# EAGLE design AeroReceiver01 (EAGLE 5.07)
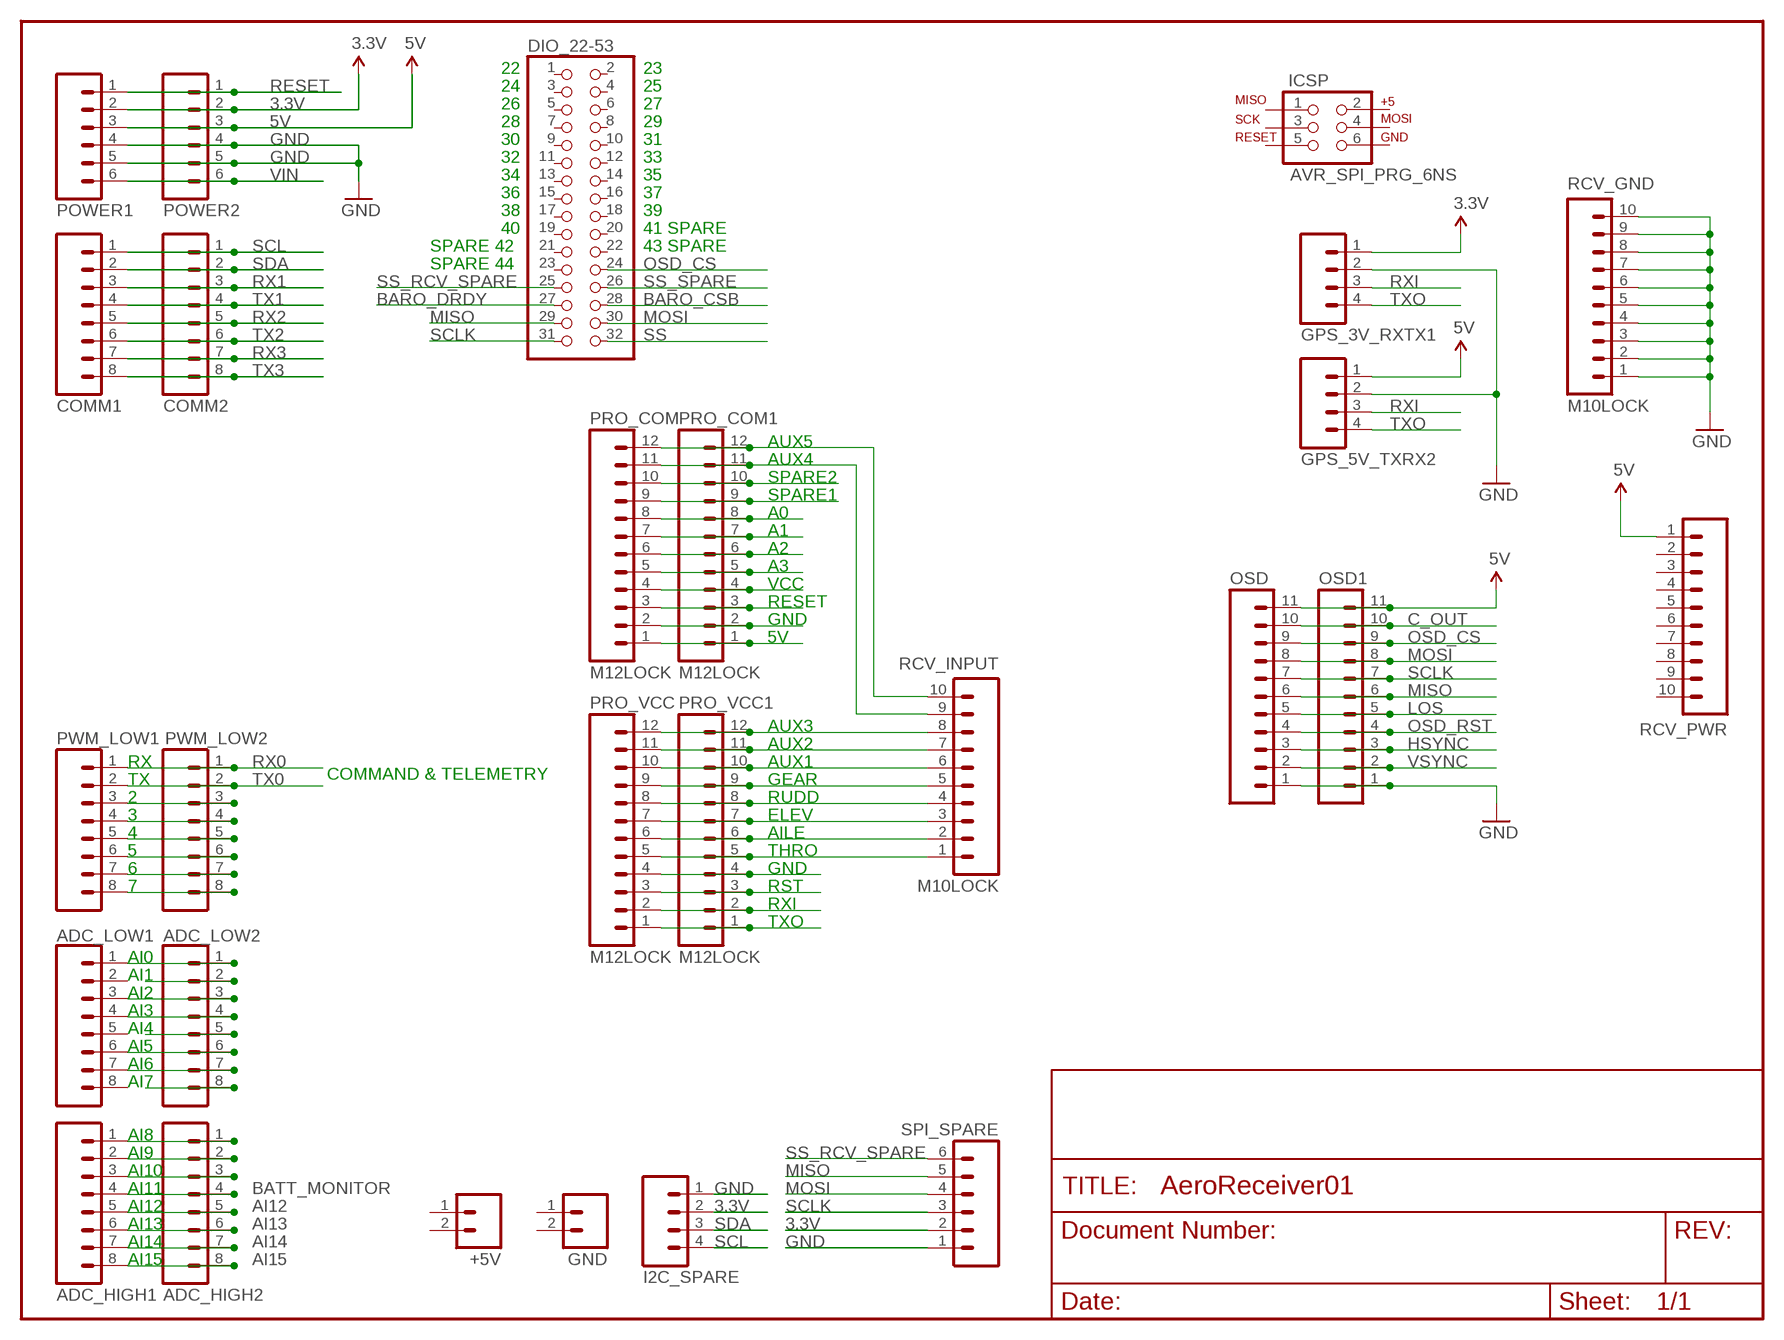
[diagram p0: schematic, sheet 1]

## Parts
+5V  M02PTH  [1X02]
ADC_HIGH1  M08LOCK  [1X08_LOCK]
ADC_HIGH2  M08LOCK  [1X08_LOCK]
ADC_LOW1  M08LOCK  [1X08_LOCK]
ADC_LOW2  M08LOCK  [1X08_LOCK]
COMM1  M08LOCK  [1X08_LOCK]
COMM2  M08LOCK  [1X08_LOCK]
DIO_22-53  PINHD-2X16  [2X16]
GND  M02PTH  [1X02]
GPS_3V_RXTX1  M04LOCK  [1X04_LOCK]
GPS_5V_TXRX2  M04LOCK  [1X04_LOCK]
I2C_SPARE  M04LOCK  [1X04_LOCK]
ICSP  AVR_SPI_PRG_6NS  [2X3-NS]
OSD  M11LOCK  [1X11_LOCK]
OSD1  M11LOCK  [1X11_LOCK]
POWER1  M06LOCK  [1X06_LOCK]
POWER2  M06LOCK  [1X06_LOCK]
PRO_COM  M12LOCK  [1X12_LOCK]
PRO_COM1  M12LOCK  [1X12_LOCK]
PRO_VCC  M12LOCK  [1X12_LOCK]
PRO_VCC1  M12LOCK  [1X12_LOCK]
PWM_LOW1  M08LOCK  [1X08_LOCK]
PWM_LOW2  M08LOCK  [1X08_LOCK]
RCV_GND  M10LOCK  [1X10_LOCK]
RCV_INPUT  M10LOCK  [1X10_LOCK]
RCV_PWR  M10LOCK  [1X10_LOCK]
SPI_SPARE  M06LOCK  [1X06_LOCK]

## Nets
3.3V: GPS_3V_RXTX1.1 I2C_SPARE.2 POWER1.2 POWER2.2 SPI_SPARE.2
5V: GPS_5V_TXRX2.1 OSD1.11 OSD.11 POWER1.3 POWER2.3 PRO_COM1.1 PRO_COM.1 RCV_PWR.1
A0: PRO_COM1.8 PRO_COM.8
A1: PRO_COM1.7 PRO_COM.7
A2: PRO_COM1.6 PRO_COM.6
A3: PRO_COM1.5 PRO_COM.5
AI12: ADC_HIGH1.5 ADC_HIGH2.5
AI13: ADC_HIGH1.6 ADC_HIGH2.6
AI14: ADC_HIGH1.7 ADC_HIGH2.7
AI15: ADC_HIGH1.8 ADC_HIGH2.8
AILE: PRO_VCC1.6 PRO_VCC.6 RCV_INPUT.2
AUX1: PRO_VCC1.10 PRO_VCC.10 RCV_INPUT.6
AUX2: PRO_VCC1.11 PRO_VCC.11 RCV_INPUT.7
AUX3: PRO_VCC1.12 PRO_VCC.12 RCV_INPUT.8
AUX4: PRO_COM1.11 PRO_COM.11 RCV_INPUT.9
AUX5: PRO_COM1.12 PRO_COM.12 RCV_INPUT.10
BARO_CSB: DIO_22-53.28
BARO_DRDY: DIO_22-53.27
BATT_MONITOR: ADC_HIGH1.4 ADC_HIGH2.4
C_OUT: OSD1.10 OSD.10
ELEV: PRO_VCC1.7 PRO_VCC.7 RCV_INPUT.3
GEAR: PRO_VCC1.9 PRO_VCC.9 RCV_INPUT.5
GND: GPS_3V_RXTX1.2 GPS_5V_TXRX2.2 I2C_SPARE.1 OSD1.1 OSD.1 POWER1.4 POWER1.5 POWER2.4 POWER2.5 PRO_COM1.2 PRO_COM.2 PRO_VCC1.4 PRO_VCC.4 RCV_GND.1 RCV_GND.2 RCV_GND.3 RCV_GND.4 RCV_GND.5 RCV_GND.6 RCV_GND.7 RCV_GND.8 RCV_GND.9 RCV_GND.10 SPI_SPARE.1
HSYNC: OSD1.3 OSD.3
LOS: OSD1.5 OSD.5
MISO: DIO_22-53.29 OSD1.6 OSD.6 SPI_SPARE.5
MOSI: DIO_22-53.30 OSD1.8 OSD.8 SPI_SPARE.4
N$1: ADC_LOW1.1 ADC_LOW2.1
N$2: ADC_LOW2.2
N$3: ADC_LOW1.3 ADC_LOW2.3
N$4: ADC_LOW1.4 ADC_LOW2.4
N$5: ADC_LOW2.5
N$6: ADC_LOW1.6 ADC_LOW2.6
N$7: ADC_LOW1.7 ADC_LOW2.7
N$8: ADC_LOW2.8
N$9: ADC_HIGH1.1 ADC_HIGH2.1
N$10: ADC_HIGH1.2 ADC_HIGH2.2
N$11: ADC_HIGH1.3 ADC_HIGH2.3
N$12: PWM_LOW1.3 PWM_LOW2.3
N$13: PWM_LOW1.4 PWM_LOW2.4
N$14: PWM_LOW1.5 PWM_LOW2.5
N$15: PWM_LOW1.6 PWM_LOW2.6
N$16: PWM_LOW1.7 PWM_LOW2.7
N$17: PWM_LOW1.8 PWM_LOW2.8
OSD_CS: DIO_22-53.24 OSD1.9 OSD.9
OSD_RST: OSD1.4 OSD.4
RESET: POWER1.1 POWER2.1 PRO_COM1.3 PRO_COM.3
RST: PRO_VCC1.3 PRO_VCC.3
RUDD: PRO_VCC1.8 PRO_VCC.8 RCV_INPUT.4
RX0: PWM_LOW1.1 PWM_LOW2.1
RX1: COMM1.3 COMM2.3
RX2: COMM1.5 COMM2.5
RX3: COMM1.7 COMM2.7
RXI: GPS_3V_RXTX1.3 GPS_5V_TXRX2.3 PRO_VCC1.2 PRO_VCC.2
SCL: COMM1.1 COMM2.1 I2C_SPARE.4
SCLK: DIO_22-53.31 OSD1.7 OSD.7 SPI_SPARE.3
SDA: COMM1.2 COMM2.2 I2C_SPARE.3
SPARE1: PRO_COM1.9 PRO_COM.9
SPARE2: PRO_COM1.10 PRO_COM.10
SS: DIO_22-53.32
SS_RCV_SPARE: DIO_22-53.25 SPI_SPARE.6
SS_SPARE: DIO_22-53.26
THRO: PRO_VCC1.5 PRO_VCC.5 RCV_INPUT.1
TX0: PWM_LOW1.2 PWM_LOW2.2
TX1: COMM1.4 COMM2.4
TX2: COMM1.6 COMM2.6
TX3: COMM1.8 COMM2.8
TXO: GPS_3V_RXTX1.4 GPS_5V_TXRX2.4 PRO_VCC1.1 PRO_VCC.1
VCC: PRO_COM1.4 PRO_COM.4
VIN: POWER1.6 POWER2.6
VSYNC: OSD1.2 OSD.2
Unconnected: +5V.1 +5V.2 ADC_LOW1.2 ADC_LOW1.5 ADC_LOW1.8 DIO_22-53.1 DIO_22-53.2 DIO_22-53.3 DIO_22-53.4 DIO_22-53.5 DIO_22-53.6 DIO_22-53.7 DIO_22-53.8 DIO_22-53.9 DIO_22-53.10 DIO_22-53.11 DIO_22-53.12 DIO_22-53.13 DIO_22-53.14 DIO_22-53.15 DIO_22-53.16 DIO_22-53.17 DIO_22-53.18 DIO_22-53.19 DIO_22-53.20 DIO_22-53.21 DIO_22-53.22 DIO_22-53.23 GND.1 GND.2 ICSP.1 ICSP.2 ICSP.3 ICSP.4 ICSP.5 ICSP.6 RCV_PWR.2 RCV_PWR.3 RCV_PWR.4 RCV_PWR.5 RCV_PWR.6 RCV_PWR.7 RCV_PWR.8 RCV_PWR.9 RCV_PWR.10

## Notes on the sheet
- 22 | 23
- 24 | 25
- 26 | 27
- 28 | 29
- 30 | 31
- 32 | 33
- 34 | 35
- 36 | 37
- 38 | 39
- 40 | 41 SPARE
- SPARE 42 | 43 SPARE
- SPARE 44
- RX
- COMMAND & TELEMETRY
- TX
- 2
- 3
- 4
- 5
- 6
- 7
- AI0
- AI1
- AI2
- AI3
- AI4
- AI5
- AI6
- AI7
- AI8
- AI9
- AI10
- AI11
- AI12
- AI13
- AI14
- AI15

## Library data of the parts
+5V GND = SparkFun:M02: Header 2 Standard 2-pin 0.1" header. Use with straight break away headers (SKU : PRT-00116), right angle break away headers (PRT-00553), swiss pins (PRT-00743), machine pins (PRT-00117), and female headers (PRT-00115). Molex polarized connector foot print use with SKU : PRT-08233 with associated crimp pins and housings.
ADC_HIGH1 ADC_HIGH2 ADC_LOW1 ADC_LOW2 COMM1 COMM2 PWM_LOW1 PWM_LOW2 = SparkFun:M08: Header 8 Standard 8-pin 0.1" header. Use with straight break away headers (SKU : PRT-00116), right angle break away headers (PRT-00553), swiss pins (PRT-00743), machine pins (PRT-00117), and female headers (PRT-00115).
DIO_22-53 = pinhead:PINHD-2X16: PIN HEADER
GPS_3V_RXTX1 GPS_5V_TXRX2 I2C_SPARE = SparkFun:M04: Header 4 Standard 4-pin 0.1" header. Use with straight break away headers (SKU : PRT-00116), right angle break away headers (PRT-00553), swiss pins (PRT-00743), machine pins (PRT-00117), and female headers (PRT-00115). Molex polarized connector foot print use with SKU : PRT-08231 with associated crimp pins and housings.
ICSP = SparkFun:AVR_SPI_PRG_6: AVR ISP 6 Pin This is the reduced ISP connector for AVR programming. Common on Arduino. This footprint will take up less PCB space and can be used with a 10-pin to 6-pin adapter such as SKU: BOB-08508
OSD OSD1 = SparkFun:M11: Header 11 Standard 11-pin 0.1" header. Use with straight break away headers (SKU : PRT-00116), right angle break away headers (PRT-00553), swiss pins (PRT-00743), machine pins (PRT-00117), and female headers (PRT-00115).
POWER1 POWER2 SPI_SPARE = SparkFun:M06: Header 6 Standard 6-pin 0.1" header. Use with straight break away headers (SKU : PRT-00116), right angle break away headers (PRT-00553), swiss pins (PRT-00743), machine pins (PRT-00117), and female headers (PRT-00115). Molex polarized connector foot print use with SKU : PRT-08094 with associated crimp pins and housings. NOTES ON THE VARIANTS LOCK and LOCK_LONGPADS... This footprint was designed to help hold the alignment of a through-hole component (i.e. 6-pin header) while soldering it into place. You may notice that each hole has been shifted either up or down by 0.005 of an inch from it's more standard position (which is a perfectly straight line). This slight alteration caused the pins (the squares in the middle) to touch the edges of the holes. Because they are alternating, it causes a "brace" to hold the component in place. 0.005 has proven to be the perfect amount of "off-center" position when using our standard breakaway headers. Although looks a little odd when you look at the bare footprint, once you have a header in there, the alteration is very hard to notice. Also, if you push a header all the way into place, it is covered up entirely on the bottom side. This idea of altering the position of holes to aid alignment will be further integrated into the Sparkfun Library for other footprints. It can help hold any component with 3 or more connection pins.
PRO_COM PRO_COM1 PRO_VCC PRO_VCC1 = SparkFun:M12: Header 12 Standard 12-pin 0.1" header. Use with straight break away headers (SKU : PRT-00116), right angle break away headers (PRT-00553), swiss pins (PRT-00743), machine pins (PRT-00117), and female headers (PRT-00115).
RCV_GND RCV_INPUT RCV_PWR = SparkFun:M10: Header 10 Standard 10-pin 0.1" header. Use with straight break away headers (SKU : PRT-00116), right angle break away headers (PRT-00553), swiss pins (PRT-00743), machine pins (PRT-00117), and female headers (PRT-00115).

## Board
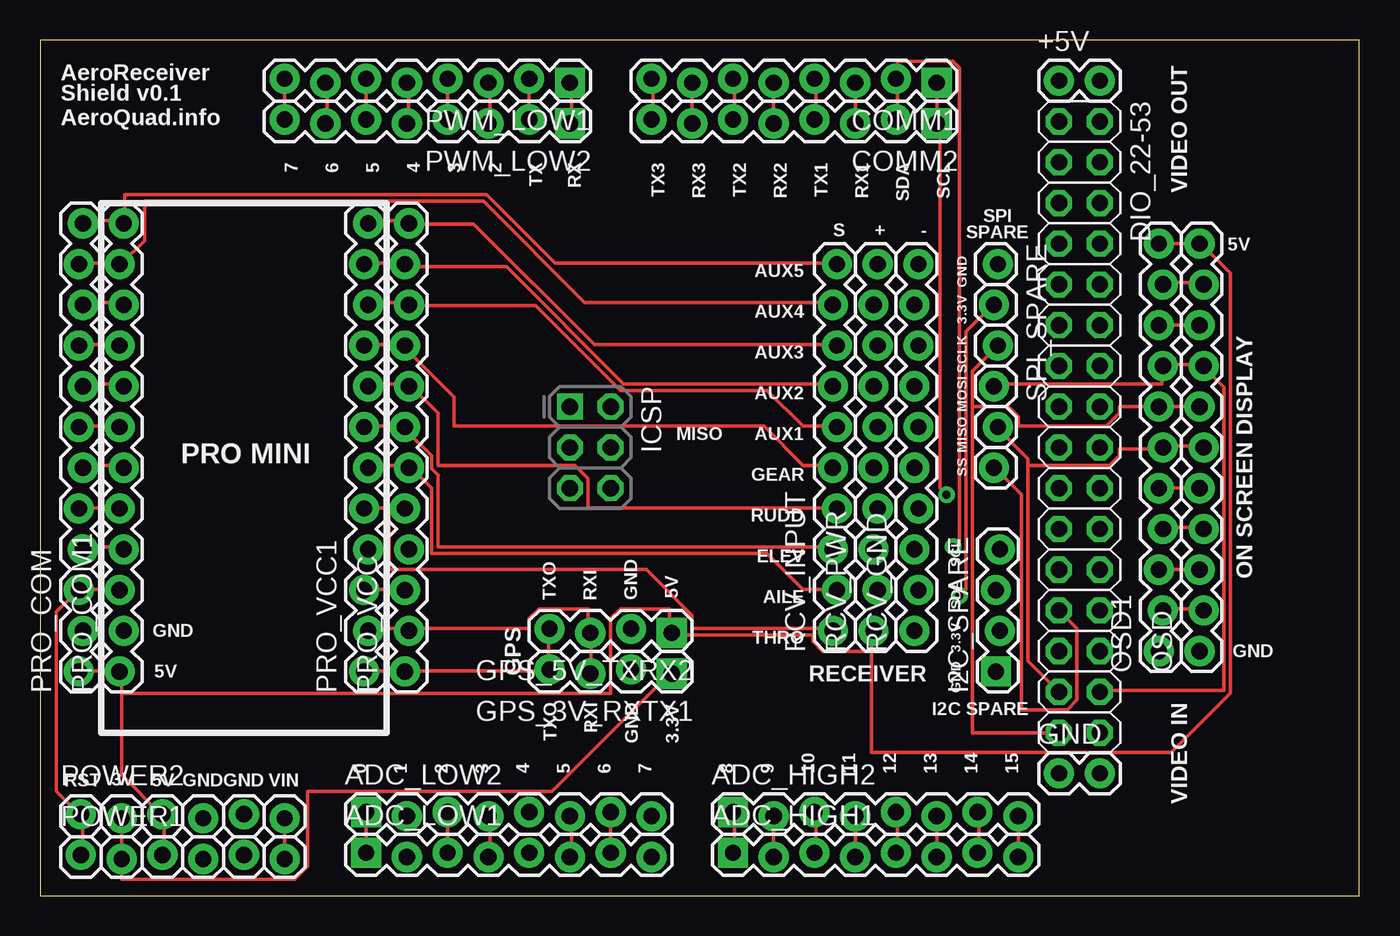
[diagram p1: board, top side]
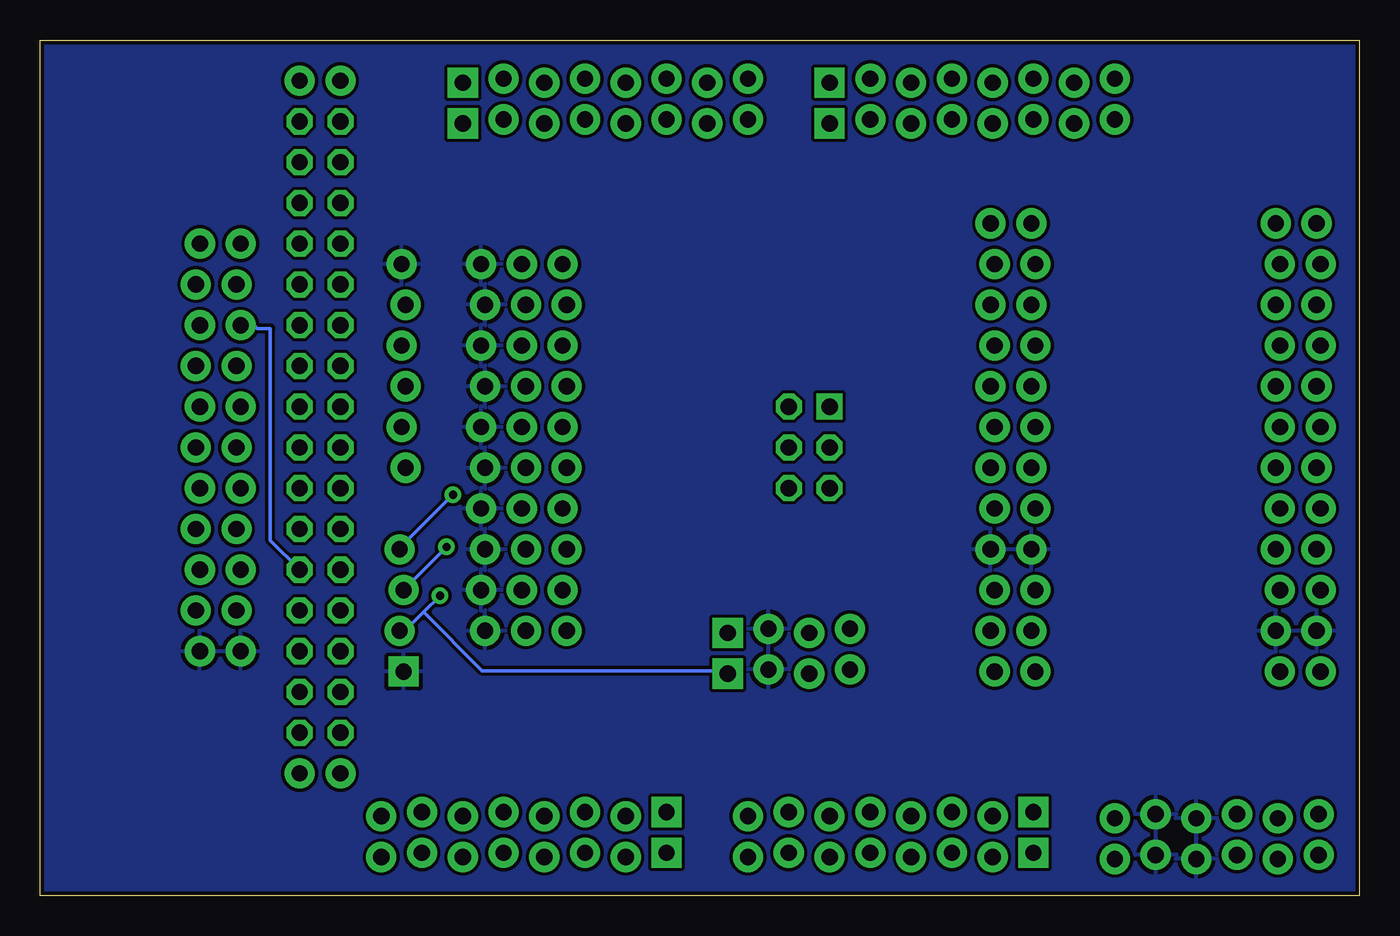
[diagram p2: board, bottom side, seen from below]

Size 82.22 x 53.33 mm. Coordinates in mm from the lower left corner, seen from the top.
Outline: 0,0 82.22,0 82.22,53.33 0,53.33 0,0
Copper layers (1*16): Top 0.035mm / dielectric 1.5mm / Bottom 0.035mm
Design rules "SparkFun": minimum track width 8mil, minimum drill 20mil, track to track 8mil, track to pad 8mil, pad to pad 8mil, via to via 8mil, smd to smd 8mil, copper to edge 10mil, drill to drill 8mil, minimum pad ring 12mil, minimum via ring 10mil, stop-mask expansion 4mil, vias tented up to drill 25mil, thermal gap 10mil

### Footprints (pad centres in the part's own frame; a part is rotated, then mirrored left to right if it is on the bottom)
1X02 = drill 1.016 pad 1.88 round: 1 0,0; 2 2.54,0
1X08_LOCK = drill 1.016 pad 1.88 square: 1 0,0.127 | drill 1.016 pad 1.88 round: 2 2.54,-0.127; 3 5.08,0.127; 4 7.62,-0.127; 5 10.16,0.127; 6 12.7,-0.127; 7 15.24,0.127; 8 17.78,-0.127
2X16 = drill 1.016 octagon: 1 -19.05,-1.27; 2 -19.05,1.27; 3 -16.51,-1.27; 4 -16.51,1.27; 5 -13.97,-1.27; 6 -13.97,1.27; 7 -11.43,-1.27; 8 -11.43,1.27; 9 -8.89,-1.27; 10 -8.89,1.27; 11 -6.35,-1.27; 12 -6.35,1.27; 13 -3.81,-1.27; 14 -3.81,1.27; 15 -1.27,-1.27; 16 -1.27,1.27; 17 1.27,-1.27; 18 1.27,1.27; 19 3.81,-1.27; 20 3.81,1.27; 21 6.35,-1.27; 22 6.35,1.27; 23 8.89,-1.27; 24 8.89,1.27; 25 11.43,-1.27; 26 11.43,1.27; 27 13.97,-1.27; 28 13.97,1.27; 29 16.51,-1.27; 30 16.51,1.27; 31 19.05,-1.27; 32 19.05,1.27
1X04_LOCK = drill 1.016 pad 1.88 square: 1 0,0.127 | drill 1.016 pad 1.88 round: 2 2.54,-0.127; 3 5.08,0.127; 4 7.62,-0.127
2X3-NS = drill 1.016 square: 1 -2.54,-1.27 | drill 1.016 octagon: 2 -2.54,1.27; 3 0,-1.27; 4 0,1.27; 5 2.54,-1.27; 6 2.54,1.27
1X11_LOCK = drill 1.016 pad 1.88 round: 1 0,0.127; 2 2.54,-0.127; 3 5.08,0.127; 4 7.62,-0.127; 5 10.16,0.127; 6 12.7,-0.127; 7 15.24,0.127; 8 17.78,-0.127; 9 20.32,0.127; 10 22.86,-0.127; 11 25.4,0.127
1X06_LOCK = drill 1.016 pad 1.88 round: 1 0,0; 2 2.54,-0.254; 3 5.08,0; 4 7.62,-0.254; 5 10.16,0; 6 12.7,-0.254
1X12_LOCK = drill 1.016 pad 1.88 round: 1 0,0.127; 2 2.54,-0.127; 3 5.08,0.127; 4 7.62,-0.127; 5 10.16,0.127; 6 12.7,-0.127; 7 15.24,0.127; 8 17.78,-0.127; 9 20.32,0.127; 10 22.86,-0.127; 11 25.4,0.127; 12 27.94,-0.127
1X10_LOCK = drill 1.016 pad 1.88 round: 1 0,0.127; 2 2.54,-0.127; 3 5.08,0.127; 4 7.62,-0.127; 5 10.16,0.127; 6 12.7,-0.127; 7 15.24,0.127; 8 17.78,-0.127; 9 20.32,0.127; 10 22.86,-0.127

### Placement (x,y rotation side)
+5V  63.5,50.8 0 top
ADC_HIGH1  43.18,2.54 0 top
ADC_HIGH2  43.18,5.08 0 top
ADC_LOW1  20.32,2.54 0 top
ADC_LOW2  20.32,5.08 0 top
COMM1  55.88,50.8 180 top
COMM2  55.88,48.26 180 top
DIO_22-53  64.77,29.21 270 top
GND  63.5,7.62 0 top
GPS_3V_RXTX1  39.37,13.97 180 top
GPS_5V_TXRX2  39.37,16.51 180 top
I2C_SPARE  59.69,13.97 90 top
ICSP  34.29,27.94 270 top
OSD  72.39,15.24 90 top
OSD1  69.85,15.24 90 top
POWER1  2.54,2.54 0 top
POWER2  2.54,5.08 0 top
PRO_COM  2.54,13.97 90 top
PRO_COM1  5.08,13.97 90 top
PRO_VCC  22.86,13.97 90 top
PRO_VCC1  20.32,13.97 90 top
PWM_LOW1  33.02,50.8 180 top
PWM_LOW2  33.02,48.26 180 top
RCV_GND  54.61,16.51 90 top
RCV_INPUT  49.53,16.51 90 top
RCV_PWR  52.07,16.51 90 top
SPI_SPARE  59.69,39.37 270 top

### Tracks (layer width: path | path; a pad name or v marks a point on that pad's centre or on a via)
3.3V  (via drill 0.51)
  Top 0.203: v57.3,18.69 57.71,19.1 57.71,35.15 59.33,36.78 SPI_SPARE.2 | POWER2.2 POWER1.2 5.08,1.02 15.85,1.02 16.66,1.83 16.66,6.5 31.9,6.5 39.22,13.82 GPS_3V_RXTX1.1
  Bottom 0.203: 58.32,17.68 59.33,16.66 59.74,16.66 I2C_SPARE.2 | 58.32,17.68 v57.3,18.69 | 58.32,17.68 54.66,14.02 39.42,14.02 GPS_3V_RXTX1.1
5V
  Top 0.203: POWER1.3 7.72,2.64 7.72,5.08 POWER2.3 7.52,5.08 5.08,7.52 5.08,12.6 | PRO_COM.1 2.44,14.02 4.88,14.02 PRO_COM1.1 5.08,13.82 5.08,12.6 | OSD1.11 OSD.11 72.34,40.64 74.17,38.81 74.17,12.6 70.51,8.94 51.82,8.94 51.82,15.24 | 51.82,15.24 48.77,15.24 48.16,15.85 48.16,16.26 39.42,16.26 GPS_5V_TXRX2.1 39.22,16.46 39.22,17.88 36.17,17.88 35.56,17.27 35.56,12.6 5.08,12.6 | 51.82,15.24 51.82,16.46 RCV_PWR.1
A0
  Top 0.203: PRO_COM.8 2.85,31.9 5.08,31.9 PRO_COM1.8
A1
  Top 0.203: PRO_COM.7 2.44,29.26 4.88,29.26 PRO_COM1.7
A2
  Top 0.203: PRO_COM.6 2.85,26.82 5.08,26.82 PRO_COM1.6
A3
  Top 0.203: PRO_COM.5 2.44,24.18 4.88,24.18 PRO_COM1.5
AI12
  Top 0.203: ADC_HIGH1.5 53.44,2.85 53.44,5.08 ADC_HIGH2.5
AI13
  Top 0.203: ADC_HIGH1.6 ADC_HIGH2.6
AI14
  Top 0.203: ADC_HIGH1.7 58.52,2.85 58.52,5.08 ADC_HIGH2.7
AI15
  Top 0.203: ADC_HIGH1.8 ADC_HIGH2.8
AILE
  Top 0.203: PRO_VCC1.6 20.52,26.82 22.96,26.82 PRO_VCC.6 23.16,26.62 24.38,25.4 24.38,21.34 45.31,21.34 47.55,19.1 49.58,19.1 RCV_INPUT.2
AUX1
  Top 0.203: PRO_VCC1.10 20.52,36.98 22.96,36.98 PRO_VCC.10 23.16,36.78 30.89,36.78 36.17,31.5 45.31,31.5 47.55,29.26 49.58,29.26 RCV_INPUT.6
AUX2
  Top 0.203: PRO_VCC1.11 20.32,39.42 22.55,39.42 PRO_VCC.11 22.76,39.22 29.06,39.22 36.37,31.9 49.38,31.9 RCV_INPUT.7
AUX3
  Top 0.203: PRO_VCC1.12 20.52,42.06 22.96,42.06 PRO_VCC.12 23.16,41.86 27.03,41.86 34.54,34.34 49.58,34.34 RCV_INPUT.8
AUX4
  Top 0.203: PRO_COM.11 2.44,39.42 4.88,39.42 PRO_COM1.11 5.08,39.42 6.5,40.84 6.5,43.28 27.64,43.28 33.93,36.98 49.38,36.98 RCV_INPUT.9
AUX5
  Top 0.203: PRO_COM.12 2.85,42.06 5.08,42.06 PRO_COM1.12 5.28,42.06 5.28,43.69 27.84,43.69 32.11,39.42 49.58,39.42 RCV_INPUT.10
BATT_MONITOR
  Top 0.203: ADC_HIGH1.4 ADC_HIGH2.4
C_OUT
  Top 0.203: OSD1.10 70.1,38.2 72.34,38.2 OSD.10
ELEV
  Top 0.203: PRO_VCC1.7 20.32,29.26 22.55,29.26 PRO_VCC.7 22.76,29.06 24.38,27.43 24.38,26.62 24.79,26.21 24.79,21.74 49.38,21.74 RCV_INPUT.3
GEAR
  Top 0.203: PRO_VCC1.9 20.32,34.34 22.55,34.34 PRO_VCC.9 22.76,34.14 25.81,31.09 25.81,29.26 45.11,29.26 47.55,26.82 49.38,26.82 RCV_INPUT.5
GND
  pour Bottom: 0,0 0,53.34 82.55,53.34 82.55,0
HSYNC
  Top 0.203: OSD1.3 OSD.3
LOS
  Top 0.203: OSD1.5 OSD.5
MISO
  Top 0.203: OSD.6 72.34,28.04 70.1,28.04 OSD1.6 69.9,27.84 67.26,27.84 67.26,27.43 66.65,26.82 61.57,26.82 | 61.57,26.82 61.57,27.23 59.74,29.06 SPI_SPARE.5 | 61.57,26.82 61.57,14.63 DIO_22-53.29
MOSI
  Top 0.203: SPI_SPARE.4 59.54,31.9 69.9,31.9 69.9,32.92 OSD1.8 70.1,33.12 72.34,33.12 OSD.8 72.54,32.92 73.76,31.7 73.76,12.8 66.04,12.8 DIO_22-53.30
N$1
  Top 0.203: ADC_LOW1.1 ADC_LOW2.1
N$3
  Top 0.203: ADC_LOW1.3 ADC_LOW2.3
N$4
  Top 0.203: ADC_LOW1.4 28.04,2.44 28.04,4.88 ADC_LOW2.4
N$6
  Top 0.203: ADC_LOW1.6 33.12,2.44 33.12,4.88 ADC_LOW2.6
N$7
  Top 0.203: ADC_LOW1.7 ADC_LOW2.7
N$9
  Top 0.203: ADC_HIGH1.1 43.28,2.85 43.28,5.08 ADC_HIGH2.1
N$10
  Top 0.203: ADC_HIGH1.2 ADC_HIGH2.2
N$11
  Top 0.203: ADC_HIGH1.3 48.36,2.85 48.36,5.08 ADC_HIGH2.3
N$12
  Top 0.203: PWM_LOW2.3 28.04,48.16 28.04,50.6 PWM_LOW1.3
N$13
  Top 0.203: PWM_LOW2.4 PWM_LOW1.4
N$14
  Top 0.203: PWM_LOW2.5 22.96,48.16 22.96,50.6 PWM_LOW1.5
N$15
  Top 0.203: PWM_LOW2.6 PWM_LOW1.6
N$16
  Top 0.203: PWM_LOW2.7 17.88,48.16 17.88,50.6 PWM_LOW1.7
N$17
  Top 0.203: PWM_LOW2.8 PWM_LOW1.8
OSD_CS
  Top 0.203: OSD1.9 OSD.9
  Bottom 0.203: DIO_22-53.24 67.87,22.15 67.87,35.36 68.68,35.36 68.89,35.56 OSD1.9
OSD_RST
  Top 0.203: OSD1.4 70.1,22.96 72.34,22.96 OSD.4
RESET
  Top 0.203: PRO_COM1.3 4.88,19.1 2.44,19.1 PRO_COM.3 2.23,18.9 1.02,17.68 1.02,6.5 2.44,5.08 POWER2.1 2.64,5.08 2.64,2.64 POWER1.1
RST
  Top 0.203: PRO_VCC1.3 20.32,19.1 22.55,19.1 PRO_VCC.3
RUDD
  Top 0.203: PRO_VCC1.8 20.52,31.9 22.96,31.9 PRO_VCC.8 23.16,31.7 24.79,30.07 24.79,26.82 33.33,26.82 34.14,26.01 34.14,24.18 49.58,24.18 RCV_INPUT.4
RX0
  Top 0.203: PWM_LOW2.1 33.12,48.16 33.12,50.6 PWM_LOW1.1
RX1
  Top 0.203: COMM2.3 COMM1.3
RX2
  Top 0.203: COMM2.5 COMM1.5
RX3
  Top 0.203: COMM2.7 COMM1.7
RXI
  Top 0.203: PRO_VCC1.2 20.52,16.66 22.96,16.66 PRO_VCC.2 23.16,16.66 30.48,16.66 30.48,17.27 31.09,17.88 34.14,17.88 34.14,16.46 GPS_5V_TXRX2.3 34.34,16.26 34.34,14.02 GPS_3V_RXTX1.3
SCL  (via drill 0.51)
  Top 0.203: COMM1.1 COMM2.1 55.88,47.95 56.08,47.75 56.08,25.4 v56.49,24.99
  Bottom 0.203: v56.49,24.99 59.74,21.74 I2C_SPARE.4
SCLK
  Top 0.203: OSD.7 OSD1.7 67.26,30.48 67.26,30.07 66.45,29.26 60.96,29.26 60.96,29.87 60.35,30.48 58.12,30.48 | 58.12,30.48 58.12,32.72 SPI_SPARE.3 | 58.12,30.48 58.12,10.16 DIO_22-53.31
SDA  (via drill 0.51)
  Top 0.203: COMM2.2 53.44,48.56 53.44,50.8 COMM1.2 53.44,51 53.44,52.02 56.9,52.02 57.3,51.61 57.3,22.15 v56.9,21.74
  Bottom 0.203: v56.9,21.74 59.54,19.1 I2C_SPARE.3
SPARE1
  Top 0.203: PRO_COM.9 2.44,34.34 4.88,34.34 PRO_COM1.9
SPARE2
  Top 0.203: PRO_COM.10 2.85,36.98 5.08,36.98 PRO_COM1.10
SS_RCV_SPARE
  Top 0.203: DIO_22-53.25 64.62,16.66 64.62,12.19 64.01,11.58 61.16,11.58 61.16,24.99 59.54,26.62 SPI_SPARE.6
THRO
  Top 0.203: 21.74,24.18 22.55,24.18 PRO_VCC.5 | 21.74,24.18 20.32,24.18 PRO_VCC1.5 | 21.74,24.18 21.74,20.32 37.8,20.32 40.64,17.48 40.64,16.66 49.38,16.66 RCV_INPUT.1
TX0
  Top 0.203: PWM_LOW2.2 PWM_LOW1.2
TX1
  Top 0.203: COMM2.4 48.36,48.56 48.36,50.8 COMM1.4
TX2
  Top 0.203: COMM2.6 43.28,48.56 43.28,50.8 COMM1.6
TX3
  Top 0.203: COMM2.8 38.2,48.56 38.2,50.8 COMM1.8
TXO
  Top 0.203: PRO_VCC1.1 20.32,14.02 22.55,14.02 PRO_VCC.1 22.76,14.02 31.7,14.02 GPS_3V_RXTX1.4 31.7,14.22 31.7,16.46 GPS_5V_TXRX2.4
VCC
  Top 0.203: PRO_COM.4 2.85,21.74 5.08,21.74 PRO_COM1.4
VIN
  Top 0.203: POWER1.6 POWER2.6
VSYNC
  Top 0.203: OSD1.2 70.1,17.88 72.34,17.88 OSD.2

### Text on the board
tPlace: AeroReceiver | Shield v0.1 | AeroQuad.info | 7 | 6 | 5 | 4 | 3 | 2 | TX | RX | TX3 | RX3 | TX2 | RX2 | TX1 | RX1 | SDA | SCL | VIDEO OUT | SPI | S | + | - | SPARE | 5V | GND | AUX5 | AUX4 | 3.3V | SCLK | ON SCREEN DISPLAY | AUX3 | AUX2 | MOSI | MISO | MISO | AUX1 | PRO MINI | GEAR | SS | RUDD | ELEV | SCL | SDA | 5V | AILE | TXO | RXI | GND | GPS | THRO | 3.3V | GND | GND | GND | 5V | RECEIVER | TXO | RXI | GND | 3.3V | I2C SPARE | RST | 5V | GND | GND | VIN | 0 | 1 | 2 | 3 | 4 | 5 | 6 | 7 | 8 | 9 | 10 | 11 | 12 | 13 | 14 | 15 | 3V | VIDEO IN